# Altium schematic sheet RFID_PCB_Antenna_Interfaces.SchDoc
size A4
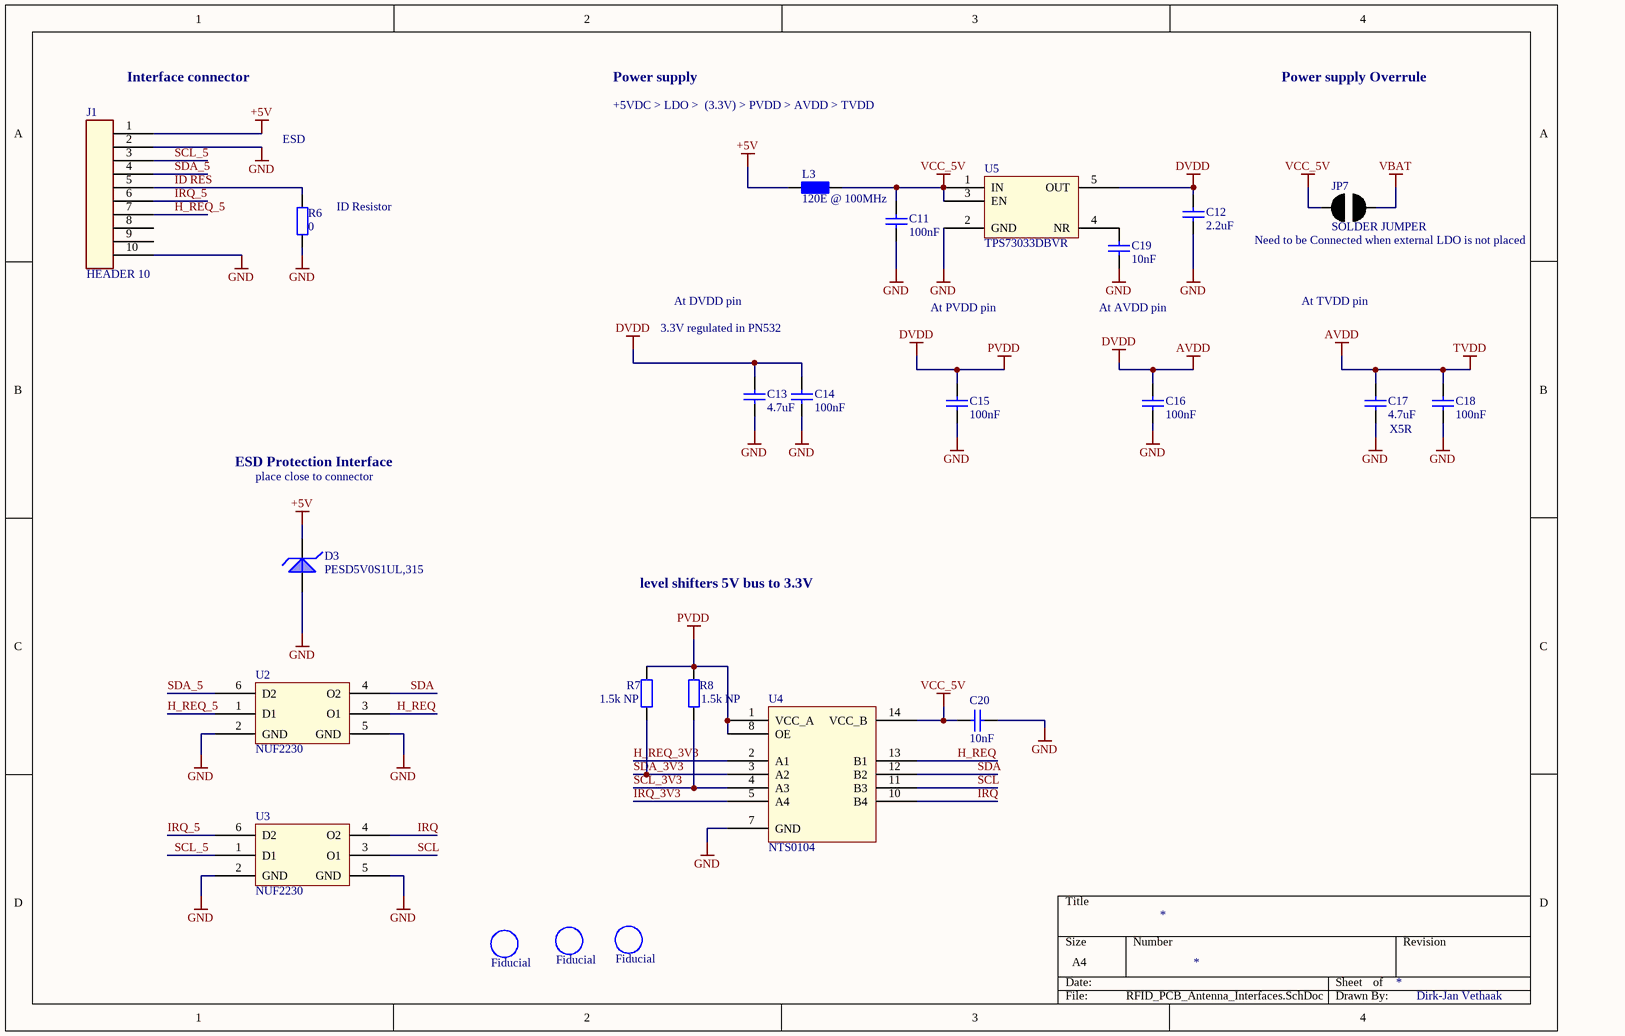
[diagram p0: RFID_PCB_Antenna_Interfaces.SchDoc]

## Parts
C11  100nF  [cap0402]
C12  2.2uF  [cap0402]
C13  4.7uF  [cap0402]
C14  100nF  [cap0402]
C15  100nF  [cap0402]
C16  100nF  [cap0402]
C17  4.7uF  [cap0402]
C18  100nF  [cap0402]
C19  10nF  [cap0402]
C20  10nF  [cap0402]
D3  Manufacturer Part Number: PESD5V0S1UL,315  [DFN65P100X50-2N]  (hidden comment: PESD5V0S1UL)
Fid1  Fiducial  [Fiducial]  (no BOM)
Fid2  Fiducial  [Fiducial]  (no BOM)
Fid3  Fiducial  [Fiducial]  (no BOM)
J1  HEADER 10  [HEADER-2X5P-ST-2]
JP7  SOLDER JUMPER  [Jumper Solder 0402]
L3  120E @ 100MHz  [R0603]
R6  0  [RESC1105X04N]
R7  1.5k NP  [RESC1105X04N]
R8  1.5k NP  [RESC1105X04N]
U2  NUF2230  [SOTFL50P160X60-6N]
U3  NUF2230  [SOTFL50P160X60-6N]
U4  NTS0104  [QFN50P300X250X100_HS-15N]
U5  TPS73033DBVR  [SOT95P280X145-5N]

## Nets
+5V: D3.1(K) J1.1 L3.1
AVDD: C12.2 C13.2 C14.2 C15.2 C16.2 C17.2 C18.2 R7.2 R8.2 U4.1(VCC_A) U4.8(OE) U5.5(OUT)  [also labelled DVDD, PVDD, TVDD]
GND: C11.1 C12.1 C13.1 C14.1 C15.1 C16.1 C17.1 C18.1 C19.2 C20.1 D3.2(A) J1.2 J1.10 R6.1 U2.2(GND) U2.5(GND) U3.2(GND) U3.5(GND) U4.7(GND) U5.2(GND)
VBAT: JP7.2
VCC_5V: C11.2 C20.2 JP7.1 L3.2 U4.14(VCC_B) U5.1(IN) U5.3(EN)
H_REQ: U2.3(O1) U4.13(B1)
H_REQ_3V3: U4.2(A1)
H_REQ_5: J1.7 U2.1(D1)
ID RES: J1.5 R6.2
IRQ: U3.4(O2) U4.10(B4)
IRQ_3V3: U4.5(A4)
IRQ_5: J1.6 U3.6(D2)
SCL: U3.3(O1) U4.11(B3)
SCL_3V3: R8.1 U4.4(A3)
SCL_5: J1.3 U3.1(D1)
SDA: U2.4(O2) U4.12(B2)
SDA_3V3: R7.1 U4.3(A2)
SDA_5: J1.4 U2.6(D2)
NetC19_1: C19.1 U5.4(NR)

Not connected (* = marked no-connect by the designer): J1 8 9; U4 6(NC) 9(NC)

## Notes on the sheet
- (near J1) Interface connector
- +5VDC > LDO >  (3.3V) > PVDD > AVDD > TVDD
- Power supply
- Power supply Overrule
- ESD
- (near R6) ID Resistor
- (near JP7) Need to be Connected when external LDO is not placed
- At DVDD pin
- At PVDD pin
- (near C19) At AVDD pin
- At TVDD pin
- 3.3V regulated in PN532
- (near C17) X5R
- ESD Protection Interface
- place close to connector
- level shifters 5V bus to 3.3V
- Dirk-Jan Vethaak

## Library data of the parts
C11 C14-C16 C18 = C0402: Manufacturer: Vishay / Vitramon; Manufacturer Part Number: VJ0402G104KXQCW1BC; Capacitance: 0.1 uF; Tolerance: 10 %; Type: Ultra Small Commodity MLCCs; Voltage Rating DC: 10 VDC; Dielectric: X5R; Qualification: Commercial; Supplier 1: Mouser; Supplier Part Number 1: 77-VJ0402G104KXQCBC; RoHS: RoHS Compliant; Category: Multilayer Ceramic Capacitors MLCC - SMD/SMT; Stock 1: 26687; Pricing 1: 1=0.100, 50=0.080, 100=0.066, 500=0.047, 1000=0.028, 10000=0.021, 20000=0.019, 50000=0.012, 100000=0.010 (USD); Height: 0.55 mm; Length: 1 mm; Package / Case: 0402 (1005 metric); Packaging: Reel; Product: General Type MLCCs; Series: VJ W1BC; Termination Style: SMD/SMT; Voltage Rating AC: -; Width: 0.5 mm; Brand: Vishay / Vitramon; Case Code - in: 0402; Case Code - mm: 1005; Maximum Operating Temperature: + 85 C; Minimum Operating Temperature: - 55 C; Product Category: Ceramic Chip Capacitors; RoHS - Mouser: Y; Minimum Order Quantity: 1; Reeling: True; ComponentLink1URL: http://www.mouser.com/ds/2/427/vjw1bcbascomseries-223529.pdf; ComponentLink1Description: http://www.mouser.com/ds/2/427/vjw1bcbascomseries-223529.pdf
C12 = C0402: Manufacturer: Murata Electronics; Manufacturer Part Number: GRM155R61A225KE95D; Tolerance: 10 %; Type: Voltage and Temperature Derating Recommended Product; Voltage Rating DC: 10 VDC; Dielectric: X5R; Product Status: New Product; Supplier 1: Mouser; Supplier Part Number 1: 81-GRM155R61A225KE5D; RoHS: RoHS Compliant; Category: Multilayer Ceramic Capacitors MLCC - SMD/SMT; Stock 1: 204336; Pricing 1: 1=0.120, 10=0.047, 100=0.028, 1000=0.022, 2500=0.018, 10000=0.016, 20000=0.014, 50000=0.013, 100000=0.010 (USD); Capacitance: 2.2 uF; Height: 0.5 mm; Length: 1 mm; Package / Case: 0402 (1005 metric); Packaging: Reel; Product: General Type MLCCs; Series: GRM; Termination Style: SMD/SMT; Width: 0.5 mm; Brand: Murata Electronics; Case Code - in: 0402; Case Code - mm: 1005; Maximum Operating Temperature: + 85 C; Minimum Operating Temperature: - 55 C; RoHS - Mouser: Y; Minimum Order Quantity: 1; Reeling: True; ComponentLink1URL: http://www.mouser.com/ds/2/281/c02e-2905.pdf; ComponentLink1Description: http://www.mouser.com/ds/2/281/c02e-2905.pdf
C13 C17 = C0402: Manufacturer: Murata Electronics; Manufacturer Part Number: GRM155R60J475ME87D; Tolerance: 20 %; Type: Voltage and Temperature Derating Recommended Product; Voltage Rating DC: 6.3 VDC; Dielectric: X5R; Product Status: New at Mouser; Supplier 1: Mouser; Supplier Part Number 1: 81-GRM155R60J475ME8D; RoHS: RoHS Compliant; Category: Multilayer Ceramic Capacitors MLCC - SMD/SMT; Stock 1: 373257; Pricing 1: 1=0.140, 10=0.056, 100=0.033, 1000=0.027, 2500=0.023, 10000=0.020, 20000=0.018, 50000=0.017, 100000=0.014 (USD); Capacitance: 4.7 uF; Height: 0.5 mm; Length: 1 mm; Package / Case: 0402 (1005 metric); Packaging: Reel; Product: General Type MLCCs; Series: GRM15; Termination Style: SMD/SMT; Width: 0.5 mm; Brand: Murata Electronics; Case Code - in: 0402; Case Code - mm: 1005; Maximum Operating Temperature: + 85 C; Minimum Operating Temperature: - 55 C; RoHS - Mouser: Y; Minimum Order Quantity: 1; Reeling: True; ComponentLink1URL: http://www.mouser.com/ds/2/281/c02e-2905.pdf; ComponentLink1Description: http://www.mouser.com/ds/2/281/c02e-2905.pdf
C19 C20 = C0402: Manufacturer: Vishay / Vitramon; Manufacturer Part Number: VJ0402Y103KXJCW1BC; Capacitance: 0.01 uF; Tolerance: 10 %; Type: Ultra Small Commodity MLCCs; Voltage Rating DC: 16 VDC; Dielectric: X7R; Qualification: Commercial; Supplier 1: Mouser; Supplier Part Number 1: 77-VJ0402Y103KXJCBC; RoHS: RoHS Compliant; Category: Multilayer Ceramic Capacitors MLCC - SMD/SMT; Stock 1: 46396; Pricing 1: 1=0.060, 50=0.050, 100=0.040, 500=0.030, 1000=0.025, 10000=0.007, 20000=0.006, 50000=0.005, 100000=0.004 (USD); Height: 0.55 mm; Length: 1 mm; Package / Case: 0402 (1005 metric); Packaging: Reel; Product: General Type MLCCs; Series: VJ W1BC; Termination Style: SMD/SMT; Voltage Rating AC: -; Width: 0.5 mm; Brand: Vishay / Vitramon; Case Code - in: 0402; Case Code - mm: 1005; Maximum Operating Temperature: + 125 C; Minimum Operating Temperature: - 55 C; Product Category: Ceramic Chip Capacitors; RoHS - Mouser: Y; Minimum Order Quantity: 1; Reeling: True; ComponentLink1URL: http://www.mouser.com/ds/2/427/vjw1bcbascomseries-223529.pdf; ComponentLink1Description: http://www.mouser.com/ds/2/427/vjw1bcbascomseries-223529.pdf
D3 = TVS Diode: TVS DIODE 5VWM 20VC SOD882; Manufacturer: NXP Semiconductors; Type: Zener; Unidirectional Channels: 1; Voltage - Reverse Standoff (Typ): 5V (Max); Voltage - Breakdown (Min): 6.4V; Voltage - Clamping (Max) @ Ipp: 20V; Current - Peak Pulse (10/1000µs): 15A (8/20µs); Power - Peak Pulse: 150W; Power Line Protection: No; Capacitance @ Frequency: 152pF @ 1MHz; Supplier 1: Digi-Key; RoHS: RoHS Compliant; Category: Circuit Protection; Stock 1: 10194; Pricing 1: 1=0.37, 10=0.278, 100=0.1732, 500=0.11838, 1000=0.091 (EUR); Packaging: Cut Tape (CT); Bidirectional Channels: -; Applications: Automotive; Operating Temperature: -65°C ~ 150°C (TA); Mounting Type: Surface Mount; Package / Case: SOD-882; Supplier Device Package: SOD-882; ComponentLink1URL: http://www.nxp.com/documents/data_sheet/PESDXS1UL_SER.pdf; ComponentLink1Description: http://www.nxp.com/documents/data_sheet/PESDXS1UL_SER.pdf; Supplier Part Number 1: 568-4802-1-ND
Fid1-Fid3 = Fiducial: ID: Library_MISC-0003; Faber ItemCode: -; Mfg: -; Mfg code: -; Value: Fiducial
J1 = HEADER 10: B10B-PHDSS(LF)(SN); Manufacturer: JST Sales America Inc.; Connector Type: Header, Shrouded; Number of Positions: 10; Number of Positions Loaded: All; Pitch: 0.079" (2.00mm); Supplier 1: Digi-Key; Manufacturer Part Number: B10B-PHDSS(LF)(SN); RoHS: RoHS Compliant; Category: Connectors, Interconnects; Stock 1: 19877; Pricing 1: 1=0.44, 10=0.418, 100=0.2924, 500=0.25058, 1000=0.20882, 5000=0.17899, 10000=0.16706 (EUR); Packaging: Bulk; Contact Type: Male Pin; Number of Rows: 2; Row Spacing: 0.079" (2.00mm); Contact Mating Length: 0.114" (2.90mm); Mounting Type: Through Hole; Termination: Solder; Fastening Type: Detent Lock; Features: -; Contact Finish: Tin; Contact Finish Thickness: -; Color: Natural; ComponentLink1URL: http://www.jst-mfg.com/product/pdf/eng/ePHD.pdf; ComponentLink1Description: http://www.jst-mfg.com/product/pdf/eng/ePHD.pdf; Supplier Part Number 1: 455-1762-ND
JP7 = JUMPER 2 SOLDER: ID: Library_CON-0010; Mfg: -; Mfg code: -; Value: SOLDER JUMPER
L3 = Ferriet Bead 120E: FERRIET BLM18PG121SN1D 0603 MURATA; Manufacturer: Murata Electronics North America; Info: Resistor; Filter Type: Power Line; Number of Lines: 1; Impedance @ Frequency: 120 Ohm @ 100MHz; Current Rating (Max): 2A; DC Resistance (DCR) (Max): 50 mOhm; ID: -; Faber ItemCode: -; Value: 120E @ 100MHz; Mfg: Murata; Mfg code: BLM18PG121SN1D; Supplier 1: Farnell; Supplier 2: Digi-Key; Manufacturer Part Number: BLM18PG121SN1D; RoHS: RoHS Compliant; Category: Filters; Stock 2: 360000; Pricing 2: 4000=0.02022, 8000=0.01832, 12000=0.01769, 28000=0.01642, 100000=0.01623 (EUR); Packaging: Tape & Reel (TR); Ratings: -; Operating Temperature: -55°C ~ 125°C; Package / Case: 0603 (1608 Metric); Mounting Type: Surface Mount; Height (Max): 0.037" (0.95mm); Size / Dimension: 0.063" L x 0.031" W (1.60mm x 0.80mm); ComponentLink1URL: http://search.murata.co.jp/Ceramy/image/img/PDF/ENG/L0110S0100BLM18P.pdf; ComponentLink1Description: http://search.murata.co.jp/Ceramy/image/img/PDF/ENG/L0110S0100BLM18P.pdf; Supplier Part Number 1: 1515738; Supplier Part Number 2: 490-1037-2-ND
R6 = R0402: Manufacturer: VISHAY; Manufacturer Part Number: CRCW04020000Z0ED; Product Range: AEC-Q200 CRCW Series; Voltage Rating: 50; Resistor Case Style: 0402 [1005 Metric]; Power Rating: 63; Resistor Element Material: Thick Film; Temperature Coefficient: ± 100; Resistor Mounting: Surface Mount Device<!--FANDB--><div class="features-and-benefits-container"><div class="features-and-benefits-description"><span class="features-benefits-value">The Vishay D/CRCW e3 series are standard thick film chip resistors. The resistance range includes E96 and E24 decade values from 1ohm to 10Mohm. CRCW e3 series resistors have a pure tin solder contacts on the Ni barrier layer that provides compatibility with reflow soldering process.</span></div><div class="features-and-benefits-list"><ul class="features-and-benefits-list-list"><li class="features-and-benefits-list-item">Automotive grade AEC-Q200 qualified</li><li class="features-and-benefits-list-item">EIA 0402, 0603, 0805, 1206, 1210, 1218, 2010, 2512 standard case sizes available</li><li class="features-and-benefits-list-item">Stability &Delta; Supplier 1: Farnell; Supplier Part Number 1: 1469661; RoHS: Y-EX; Stock 1: 83830; Pricing 1: 10=0.0078, 300=0.0062, 1000=0.0045, 2500=0.0039, 5000=0.0031 (GBP); Resistance: 0; Resistance Tolerance: -; Packaging: Cut Tape; MSL: MSL 1 - Unlimited; ComponentLink1URL: http://www.farnell.com/datasheets/2045673.pdf; ComponentLink1Description: http://www.farnell.com/datasheets/2045673.pdf; ComponentLink2URL: http://www.farnell.com/cad/1551206.zip; ComponentLink2Description: http://www.farnell.com/cad/1551206.zip
R7 R8 = R0402: Manufacturer: Vishay Dale; Manufacturer Part Number: CRCW04021K50JNED; Tolerance: ±5%; Power (Watts): 0.063W, 1/16W; Temperature Coefficient: ±200ppm/°C; Supplier 1: Digi-Key; Supplier Part Number 1: 541-1.5KJCT-ND; RoHS: RoHS Compliant; Category: Resistors; Stock 1: 23738; Pricing 1: 1=0.09, 10=0.019, 25=0.014, 50=0.011, 100=0.008, 250=0.00612, 500=0.0049, 1000=0.0036, 2500=0.00313 (EUR); Packaging: Cut Tape (CT); Resistance (Ohms): 1.5k; Composition: Thick Film; Features: Automotive AEC-Q200; Operating Temperature: -55°C ~ 155°C; Package / Case: 0402 (1005 Metric); Supplier Device Package: 0402 (1005 Metric); Size / Dimension: 0.039" L x 0.020" W (1.00mm x 0.50mm); Height: 0.016" (0.40mm); Number of Terminations: 2; ComponentLink1URL: http://www.vishay.com/docs/20035/dcrcwe3.pdf; ComponentLink1Description: http://www.vishay.com/docs/20035/dcrcwe3.pdf
U2 U3 = NUF2230: NUF2230XV6T1G; Mfg: ON Semiconductor; Filter Order: 2nd; Number of Channels: 2; Center / Cutoff Frequency: 125MHz (Cutoff); Attenuation Value: 30dB @ 800MHz ~ 900MHz; Resistance - Channel (Ohms): 100; Values: R = 100 Ohms, C = 16pF; ESD Protection: Yes; Supplier 1: Digi-Key; Supplier Part Number 1: NUF2230XV6T1GOSCT-ND; Mfg code: NUF2230XV6T1G; RoHS: RoHS Compliant; Category: Filters; Stock: 3048; Pricing: 1=0.27, 10=0.252, 25=0.2404, 50=0.2326, 100=0.2248, 250=0.21316, 500=0.17828, 1000=0.13836 (EUR); Packaging: Cut Tape (CT); Type: Low Pass; Technology: RC (Pi); Current: -; Operating Temperature: -40°C ~ 85°C; Applications: Data Lines for Mobile Devices; Package / Case: SOT-563, SOT-666; Size / Dimension: 0.063" L x 0.047" W (1.60mm x 1.20mm); Height: 0.024" (0.60mm); ComponentLink1URL: http://www.onsemi.com/pub_link/Collateral/NUF2230XV6-D.PDF; ComponentLink1Description: http://www.onsemi.com/pub_link/Collateral/NUF2230XV6-D.PDF; Manufacturer Part Number: NUF2230XV6T1G; Manufacturer: ON Semiconductor
U4 = NTS0104: NTS0104BQ,115, DHVQFN14; Manufacturer: NXP Semiconductors; Translator Type: Voltage Level; Channel Type: Bidirectional; Number of Circuits: 1; Channels per Circuit: 4; Voltage - VCCA: 1.65 V ~ 3.6 V; Voltage - VCCB: 2.3 V ~ 5.5 V; Output Type: Open Drain, Push-Pull; Data Rate: 50Mbps; Supplier 1: Digi-Key; Manufacturer Part Number: NTS0104BQ,115; RoHS: RoHS Compliant; Category: Integrated Circuits (ICs); Stock 1: 6000; Pricing 1: 3000=0.33105, 6000=0.3145, 15000=0.30267, 30000=0.29322, 75000=0.28376 (EUR); Packaging: Tape & Reel (TR); Input Signal: -; Output Signal: -; Operating Temperature: -40°C ~ 125°C (TA); Features: Auto-Direction Sensing; Mounting Type: Surface Mount; Package / Case: 14-VFQFN Exposed Pad; Supplier Device Package: 14-DHVQFN (2.5x3); ComponentLink1URL: http://www.nxp.com/documents/data_sheet/NTS0104.pdf; ComponentLink1Description: http://www.nxp.com/documents/data_sheet/NTS0104.pdf; Supplier Part Number 1: 568-8407-2-ND
U5 = TPS73033DBVR: LDO 3.3V; Manufacturer: Texas Instruments; Regulator Topology: Positive Fixed; Current - Output: 200mA; Voltage - Dropout (Typical): 0.12V @ 200mA; Number of Regulators: 1; Voltage - Input: Up to 5.5V; Current - Limit (Min): 285mA; Supplier 1: Digi-Key; Manufacturer Part Number: TPS73033DBVR; RoHS: RoHS Compliant; Category: Integrated Circuits (ICs); Stock 1: 21892; Pricing 1: 1=0.6, 10=0.528, 100=0.4043, 500=0.32032, 1000=0.25657 (EUR); Packaging: Cut Tape (CT); Voltage - Output: 3.3V; Operating Temperature: -40°C ~ 125°C; Mounting Type: Surface Mount; Package / Case: SC-74A, SOT-753; Supplier Device Package: SOT-23-5; ComponentLink1URL: http://www.ti.com/lit/ds/symlink/tps730.pdf; ComponentLink1Description: http://www.ti.com/lit/ds/symlink/tps730.pdf